# Altium schematic sheet BuckSch.SchDoc
size A4; SheetNumber: 1; SheetTotal: 1
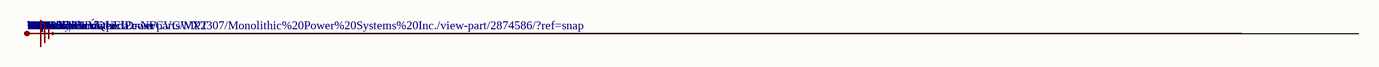
[diagram p0: BuckSch.SchDoc]

## Notes on the sheet
- MP2307|UNÝQUEID=NFCVGWXT